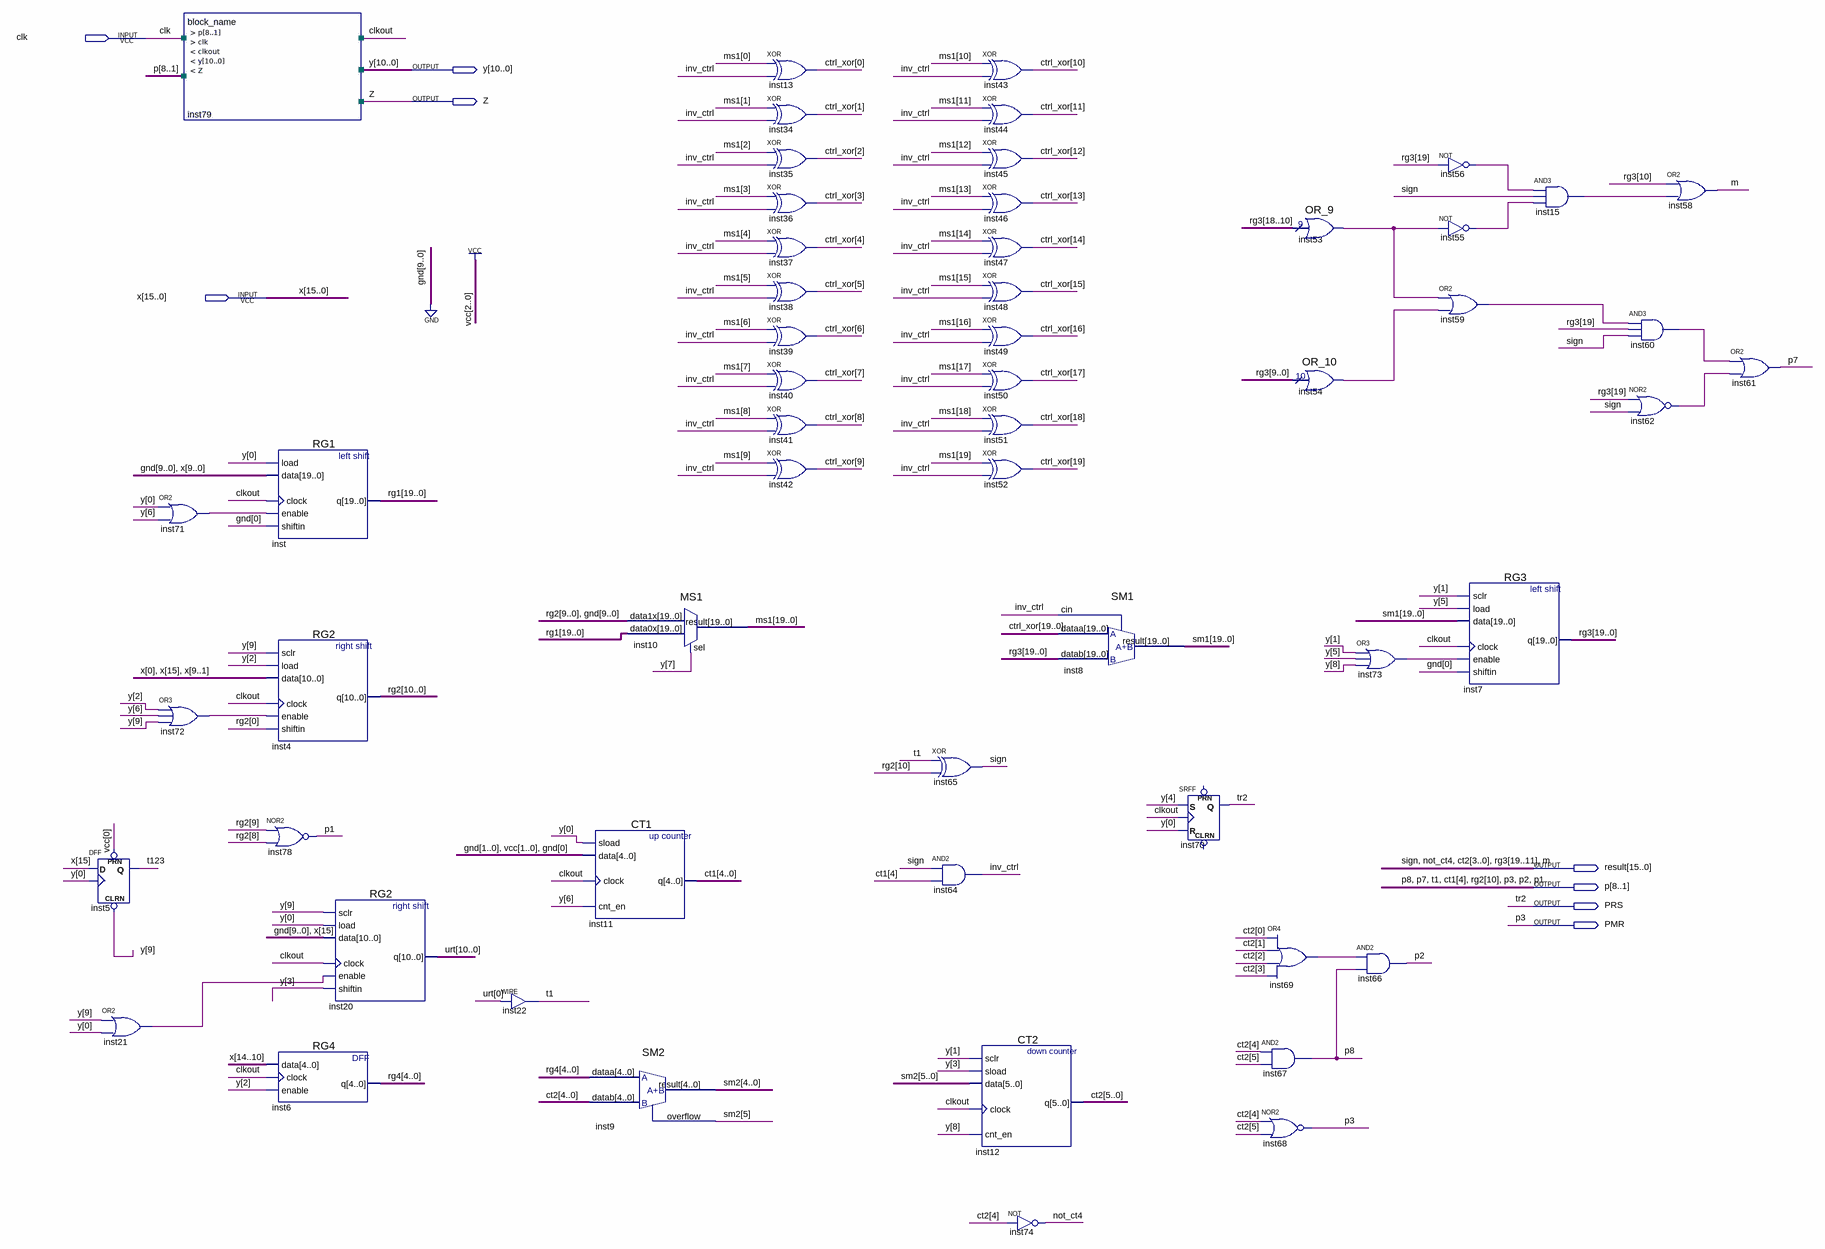
[diagram p0: schematic sheet]
// Quartus schematic lab_1.bdf as structural Verilog: 56 symbols, 8 pins
module lab_1 (
  input  clk,
  input  [15:0] x,
  output [10:0] y,
  output Z,
  output [15:0] result,
  output [8:1] p,
  output PRS,
  output PMR
);

  wire clkout, inst15_out, inst21_out, inst53_result, inst54_result, inst55_out, inst56_out, inst59_out,
       inst60_out, inst62_out, inst69_out, inst71_out, inst72_out, inst73_out, inv_ctrl, t123;
  wire [3:0] ct1;
  wire [4:0] rg4;
  wire [5:0] sm2;
  wire [5:4] ct2;
  wire [9:0] rg2;
  wire [10:0] rg3, urt;
  wire [19:0] ctrl_xor, ms1, rg1, sm1;

  DFF inst5 (.CLRN(y[9]), .CLK(y[0]), .D(x[15]), .PRN(1'b1), .Q(t123));
  or inst21 (inst21_out, y[9], y[0]);
  or inst71 (inst71_out, y[0], y[6]);
  or inst72 (inst72_out, y[2], y[6], y[9]);
  block_name inst79 (.p(p), .clk(clk), .clkout(clkout), .y(y), .Z(Z));
  RG1 inst (.load(y[0]), .data({{10{1'b0}}, x[9:0]}), .clock(clkout), .enable(inst71_out), .shiftin(1'b0), .q(rg1));
  RG2 inst4 (
    .sclr(y[9]), .load(y[2]), .data({x[0], x[15], x[9:1]}), .clock(clkout), .enable(inst72_out),
    .shiftin(rg2[0]), .q({p[4], rg2}));
  nor inst78 (p[1], rg2[9], rg2[8]);
  RG4 inst6 (.data(x[14:10]), .clock(clkout), .enable(y[2]), .q(rg4));
  RG2 inst20 (
    .sclr(y[9]), .load(y[0]), .data({{10{1'b0}}, x[15]}), .clock(clkout), .enable(inst21_out),
    .shiftin(y[3]), .q(urt));
  assign p[6] = urt[0];  // WIRE inst22
  CT1 inst11 (.sload(y[0]), .data(5'b00110), .clock(clkout), .cnt_en(y[6]), .q({p[5], ct1}));
  MS1 inst10 (.data1x({rg2, {10{1'b0}}}), .data0x(rg1), .sel(y[7]), .result(ms1));
  SM2 inst9 (.dataa(rg4), .datab({ct2[4], result[13:10]}), .result(sm2[4:0]), .overflow(sm2[5]));
  xor inst13 (ctrl_xor[0], ms1[0], inv_ctrl);
  xor inst34 (ctrl_xor[1], ms1[1], inv_ctrl);
  xor inst35 (ctrl_xor[2], ms1[2], inv_ctrl);
  xor inst36 (ctrl_xor[3], ms1[3], inv_ctrl);
  xor inst37 (ctrl_xor[4], ms1[4], inv_ctrl);
  xor inst38 (ctrl_xor[5], ms1[5], inv_ctrl);
  xor inst39 (ctrl_xor[6], ms1[6], inv_ctrl);
  xor inst40 (ctrl_xor[7], ms1[7], inv_ctrl);
  xor inst41 (ctrl_xor[8], ms1[8], inv_ctrl);
  xor inst42 (ctrl_xor[9], ms1[9], inv_ctrl);
  xor inst65 (result[15], p[6], p[4]);
  and inst64 (inv_ctrl, result[15], p[5]);
  xor inst43 (ctrl_xor[10], ms1[10], inv_ctrl);
  xor inst44 (ctrl_xor[11], ms1[11], inv_ctrl);
  xor inst45 (ctrl_xor[12], ms1[12], inv_ctrl);
  xor inst46 (ctrl_xor[13], ms1[13], inv_ctrl);
  xor inst47 (ctrl_xor[14], ms1[14], inv_ctrl);
  xor inst48 (ctrl_xor[15], ms1[15], inv_ctrl);
  xor inst49 (ctrl_xor[16], ms1[16], inv_ctrl);
  xor inst50 (ctrl_xor[17], ms1[17], inv_ctrl);
  xor inst51 (ctrl_xor[18], ms1[18], inv_ctrl);
  xor inst52 (ctrl_xor[19], ms1[19], inv_ctrl);
  CT2 inst12 (.sclr(y[1]), .sload(y[3]), .data(sm2), .clock(clkout), .cnt_en(y[8]), .q({ct2, result[13:10]}));
  not inst74 (result[14], ct2[4]);
  SM1 inst8 (.dataa(ctrl_xor), .datab({result[9:1], rg3}), .cin(inv_ctrl), .result(sm1));
  SRFF inst70 (.S(y[4]), .R(y[0]), .CLK(clkout), .Q(PRS));  // open: PRN, CLRN
  OR_9 inst53 (.data({result[8:1], rg3[10]}), .result(inst53_result));
  OR_10 inst54 (.data(rg3[9:0]), .result(inst54_result));
  or inst69 (inst69_out, result[10], result[11], result[12], result[13]);
  and inst67 (p[8], ct2[4], ct2[5]);
  nor inst68 (p[3], ct2[4], ct2[5]);
  or inst73 (inst73_out, y[1], y[5], y[8]);
  and inst66 (p[2], inst69_out, p[8]);
  not inst56 (inst56_out, result[9]);
  not inst55 (inst55_out, inst53_result);
  or inst59 (inst59_out, inst53_result, inst54_result);
  RG3 inst7 (
    .sclr(y[1]), .load(y[5]), .data(sm1), .clock(clkout), .enable(inst73_out), .shiftin(1'b0),
    .q({result[9:1], rg3}));
  and inst15 (inst15_out, inst56_out, result[15], inst55_out);
  and inst60 (inst60_out, inst59_out, result[9], result[15]);
  nor inst62 (inst62_out, result[9], result[15]);
  or inst58 (result[0], rg3[10], inst15_out);
  or inst61 (p[7], inst60_out, inst62_out);

  assign PMR = p[3];

  // Other names for the same wires on the sheet: ct1[4] = p[5]; ct2[3:0] = result[13:10]; m = result[0];
  //   not_ct4 = result[14]; rg2[10] = p[4]; rg3[19:11] = result[9:1]; sign = result[15]; t1 = p[6]; tr2 = PRS
endmodule
